# EAGLE design pow_switch_sustainer (EAGLE 9.6.2)
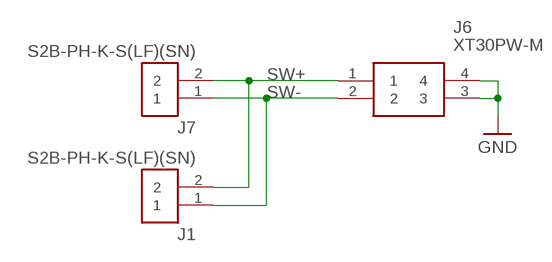
[diagram p0: schematic, sheet 1]

## Parts
J1  S2B-PH-K-S(LF)(SN)  [S2B-PH-K-S(LF)(SN)]
J6  XT30PW-M  [XT30PWM]
J7  S2B-PH-K-S(LF)(SN)  [S2B-PH-K-S(LF)(SN)]

## Nets
GND: J6.3 J6.4
SW+: J1.2 J6.1 J7.2
SW-: J1.1 J6.2 J7.1

## Library data of the parts
J1 J7 = Connectors:S2B-PH-K-S(LF)(SN): CONN HEADER R/A 2POS 2MM Manufacturer's datasheet <http://www.jst-mfg.com/product/pdf/eng/ePH.pdf>; CREATED_BY: PCBLayout.com; DIGI_KEY_PART_NUMBER: 455-1719-ND; MANUFACTURER: JST Sales America Inc.; MPN: S2B-PH-K-S(LF)(SN)
J6 = SamacSys_Parts:XT30PW-M: 30A Low Temperature Rise Fire Retardant Plug Source: Datasheet <https://www.tme.eu/sl/Document/ce4077e36b79046da520ca73227e15de/XT30PW SPEC.pdf>; DESCRIPTION: 30A Low Temperature Rise Fire Retardant Plug; HEIGHT: 5mm; MANUFACTURER_NAME: Amass; MANUFACTURER_PART_NUMBER: XT30PW-M

## Board
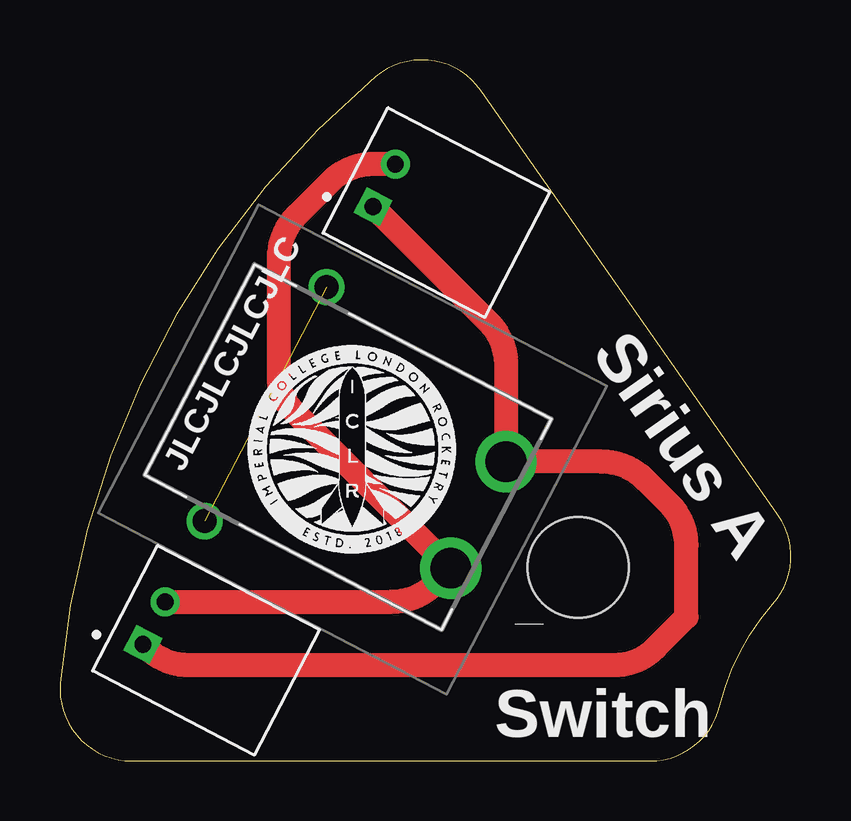
[diagram p1: board, top side]
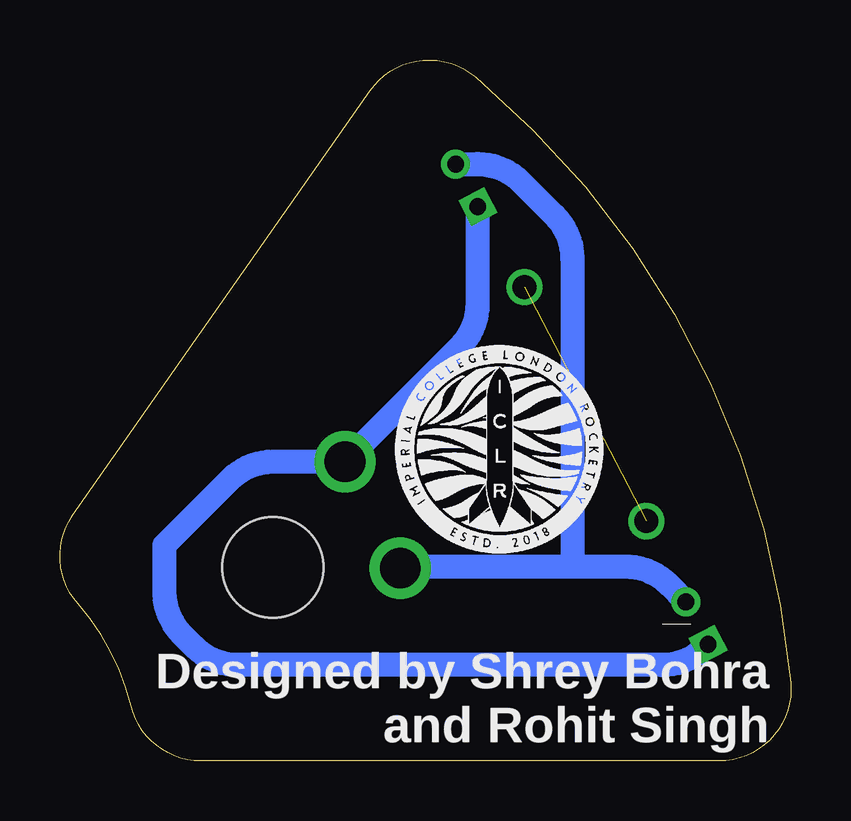
[diagram p2: board, bottom side, seen from below]

Size 30.48 x 29.23 mm. Coordinates in mm from the lower left corner, seen from the top.
Outline: 0.01,3.26 arc95 3,0 24.6,0 arc77 27.52,2.3 arc-28 29.73,6.55 arc77 29.94,10.26 17.55,27.95 arc95 13.16,28.52 arc45 0.01,3.26
Copper layers (1*16): Top 0.035mm / dielectric 1.5mm / Bottom 0.035mm
Design rules "default": minimum track width 6mil, minimum drill 0.35mm, track to track 6mil, track to pad 6mil, pad to pad 6mil, via to via 6mil, smd to smd 6mil, copper to edge 40mil, drill to drill 6mil, minimum pad ring 10mil, minimum via ring 8mil, stop-mask expansion 4mil, vias tented up to drill 0mil, thermal gap 10mil
Holes 4.2 mm at 21.6,8.08

### Footprints (pad centres in the part's own frame; a part is rotated, then mirrored left to right if it is on the bottom)
S2B-PH-K-S(LF)(SN) = drill 0.7 square: 1 -1,0 | drill 0.7: 2 1,0
XT30PWM = drill 1.7 pad 2.55: 1 -2.5,-5.912; 2 2.5,-5.912 | drill 1 pad 1.5: 3 5.5,4.088; 4 -5.5,4.088

### Placement (x,y rotation side)
J1  13.52,24 62.5 top
J6  12.2,12.99 62.5 top
J7  3.92,5.75 62.5 top

### Tracks (layer width: path | path; a pad name or v marks a point on that pad's centre or on a via)
GND  (1 unrouted)
SW+
  Top 1: J7.2 13.83,6.64 arc45 15.63,7.38 J6.1 9.68,14.65 arc-45 9.12,16 9.12,20.95 arc-45 9.86,22.74 11.26,24.14 arc-45 13.06,24.89 J1.2
  Bottom 1: J7.2 5.1,7.36 arc-45 6.9,8.1 9.12,8.1 | J6.1 arc45 16.15,8.1 9.12,8.1 | J1.2 13.06,24.89 arc45 11.26,24.14 9.86,22.74 arc45 9.12,20.95 9.12,8.1
SW-
  Top 1: J7.1 3.58,4.74 arc45 5.37,4 23.12,4 arc45 24.83,4.71 26.12,6 26.12,9 arc45 25.41,10.71 24.38,11.73 arc45 22.59,12.48 J6.2 18.6,16.52 arc45 17.85,18.32 J1.1
  Bottom 1: J7.1 3.58,4.74 arc45 5.37,4 23.07,4 arc45 24.86,4.74 25.37,5.26 arc45 26.12,7.05 26.12,9 23.38,11.73 arc45 21.59,12.48 J6.2 13.8,17.27 arc-45 13.06,19.07 J1.1

### Text on the board
tPlace: Sirius A | JLCJLCJLCJLC | Switch
bPlace: Designed by Shrey Bohra / and Rohit Singh